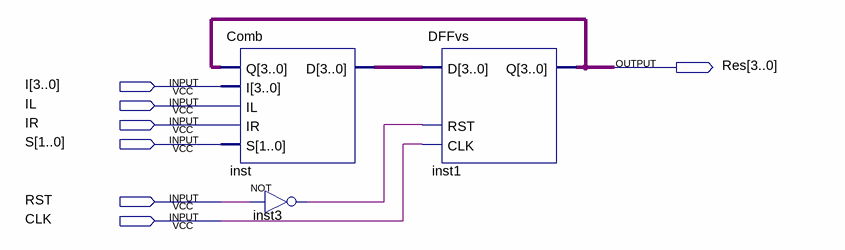
[diagram p0: schematic sheet]
// Quartus schematic VersatileShifter.bdf as structural Verilog: 3 symbols, 7 pins
module VersatileShifter (
  input  [3:0] I,
  input  IL,
  input  IR,
  input  [1:0] S,
  input  RST,
  input  CLK,
  output [3:0] Res
);

  wire inst3_out;
  wire [3:0] inst_d;

  Comb inst (.Q(Res), .I(I), .IL(IL), .IR(IR), .S(S), .D(inst_d));
  not inst3 (inst3_out, RST);
  DFFvs inst1 (.D(inst_d), .RST(inst3_out), .CLK(CLK), .Q(Res));
endmodule
